# Altium schematic sheet Peripherals.SchDoc: Peripheral Connectors
size A4; Address3: Self Checkout Shopping Cart; DocumentNumber: 1; Revision: 1.0; SheetNumber: 7; SheetTotal: 7
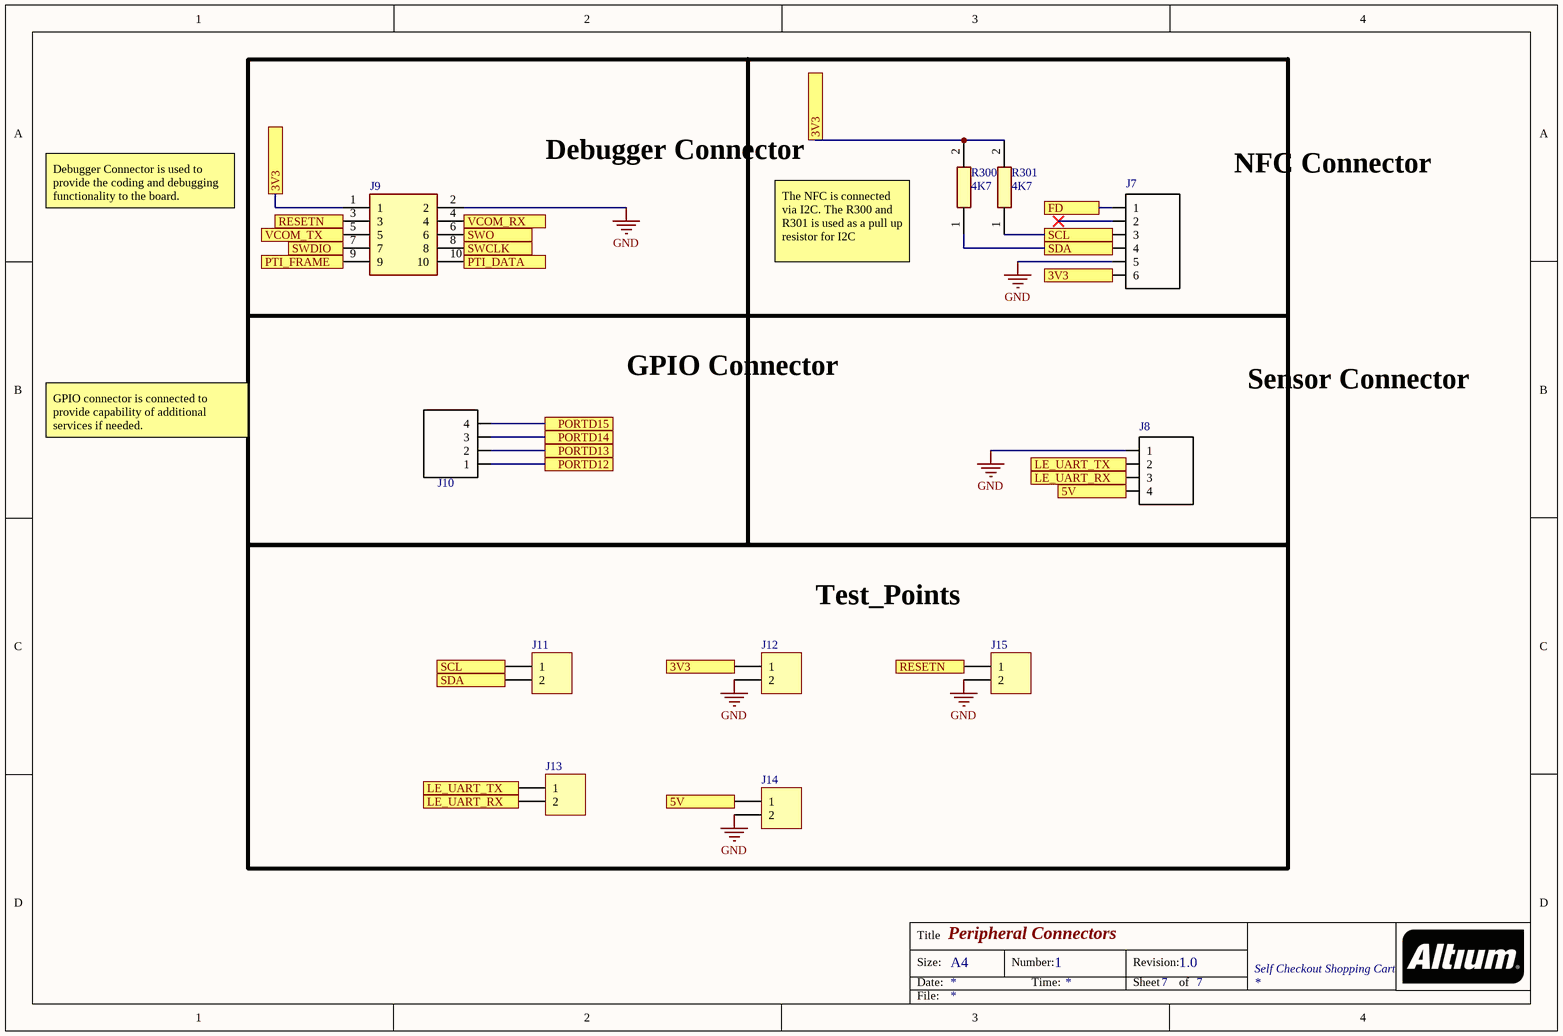
[diagram p0: Peripherals.SchDoc]

## Parts
J7  BG300-06-X-X-A_REVC  [*GCT_BG300-06-X-X-A_REVC]  (value not drawn)
J8  BG301-04-X-XXXX-X-X_REVC  [*GCT_BG301-04-X-XXXX-X-X_REVC]  (value not drawn)
J9  FTSH-105-01-L-DV-K-TR  [FTSH10501LDVKTR]  (value not drawn)
J10  BG301-04-X-XXXX-X-X_REVC  [*GCT_BG301-04-X-XXXX-X-X_REVC]  (value not drawn)
J11  Header 2  [HDR1X2]  (value not drawn)
J12  Header 2  [HDR1X2]  (value not drawn)
J13  Header 2  [HDR1X2]  (value not drawn)
J14  Header 2  [HDR1X2]  (value not drawn)
J15  Header 2  [HDR1X2]  (value not drawn)
R300  value 4K7  [RESC1608X50N]  (hidden comment: RCS06034K70FKEA)
R301  value 4K7  [RESC1608X50N]  (hidden comment: RCS06034K70FKEA)

## Blocks framed on the sheet
Test_Points: J11-J15

## Ports
3V3, 5V, FD, LE_UART_RX, LE_UART_TX, PORTD12, PORTD13, PORTD14, PORTD15, PTI_DATA, PTI_FRAME, RESETN, SCL, SDA, SWCLK, SWDIO, SWO, VCOM_RX, VCOM_TX

## Nets
GND: J7.5 J8.1 J9.2 J12.2 J14.2 J15.2
3V3: J7.6 J9.1 J12.1 R300.2 R301.2 ; port 3V3
5V: J8.4 J14.1 ; port 5V
FD: J7.1 ; port FD
LE_UART_RX: J8.3 J13.2 ; port LE_UART_RX
LE_UART_TX: J8.2 J13.1 ; port LE_UART_TX
PORTD12: J10.1 ; port PORTD12
PORTD13: J10.2 ; port PORTD13
PORTD14: J10.3 ; port PORTD14
PORTD15: J10.4 ; port PORTD15
PTI_DATA: J9.10 ; port PTI_DATA
PTI_FRAME: J9.9 ; port PTI_FRAME
RESETN: J9.3 J15.1 ; port RESETN
SCL: J7.3 J11.1 R301.1 ; port SCL
SDA: J7.4 J11.2 R300.1 ; port SDA
SWCLK: J9.8 ; port SWCLK
SWDIO: J9.7 ; port SWDIO
SWO: J9.6 ; port SWO
VCOM_RX: J9.4 ; port VCOM_RX
VCOM_TX: J9.5 ; port VCOM_TX

Not connected (* = marked no-connect by the designer): J7 2*

## Notes on the sheet
- (near J9) Debugger Connector
- NFC Connector
- Debugger Connector is used to provide the coding and debugging functionality to the board.
- The NFC is connected via I2C. The R300 and R301 is used as a pull up resistor for I2C
- (near J10) GPIO Connector
- GPIO connector is connected to provide capability of additional services if needed.
- Sensor Connector
- Title
- Size:
- Date:
- A4
- Number:
- Time:
- Revision:
- Sheet
- of
- File:

## Library data of the parts
J7 = BG300-06-X-X-A_REVC: 6 POS Right Angle Header; Manufacturer_Part_Number: BG300-06-A-L-A; Manufacturer_Name: Global Connector Technology; Detailed Description: 6 Position Receptacle Connector Surface Mount, Right Angle; Digikey Price/Stock: https://www.digikey.com/product-detail/en/gct/BG300-06-A-L-A/2073-BG300-06-A-L-ACT-ND/9859667?utm_source=snapeda&utm_medium=aggregator&utm_campaign=symbol; Digi-Key Part Number: 2073-BG300-06-A-L-ACT-ND; Value: *
J8 J10 = BG301-04-X-XXXX-X-X_REVC: 4 POS Right Angle Header; Manufacturer_Part_Number: BG301-04-A-0540-L-B; Manufacturer_Name: Global Connector Technology; Digikey Price/Stock: https://www.digikey.com/product-detail/en/gct/BG301-04-A-0540-L-B/2073-BG301-04-A-0540-L-BCT-ND/9859670?utm_source=snapeda&utm_medium=aggregator&utm_campaign=symbol; Digi-Key Part Number: 2073-BG301-04-A-0540-L-BCT-ND; Value: *; Detailed Description: *
J9 = FTSH-105-01-L-DV-K-TR: Connector; Manufacturer_Name: SAMTEC; Datasheet Link: http://suddendocs.samtec.com/catalog_english/ftsh_th.pdf; Height: 5.56mm; Manufacturer_Part_Number: FTSH-105-01-L-DV-K-TR; Mouser Part Number: 200-FTSH10501LDVKTR; Mouser Price/Stock: https://www.mouser.com/Search/Refine.aspx?Keyword=200-FTSH10501LDVKTR; RS Part Number: 1803002P; RS Price/Stock: http://uk.rs-online.com/web/p/products/1803002P
J11-J15 = Header 2: Header, 2-Pin; Manufacturer_Part_Number: BG301-04-A-0540-L-B; Manufacturer_Name: Global Connector Technology; Digi-Key Part Number: 2073-BG301-02-A-0540-L-BCT-ND; Value: *; Digikey Price/Stock: https://www.digikey.com/product-detail/en/gct/BG301-04-A-0540-L-B/2073-BG301-04-A-0540-L-BCT-ND/9859670?utm_source=snapeda&utm_medium=aggregator&utm_campaign=symbol
R300 R301 = RCS06034K70FKEA: Resistor; Manufacturer_Name: Vishay; Datasheet Link: https://www.vishay.com/docs/20065/rcse3.pdf; Height: 0.5mm; Manufacturer_Part_Number: RCS06034K70FKEA; Mouser Part Number: 71-RCS06034K70FKEA; Mouser Price/Stock: https://www.mouser.com/Search/Refine.aspx?Keyword=71-RCS06034K70FKEA